# EasyEDA Pro project ProProject_开关电源实验平台_2024-07-17.epro, board PCB4
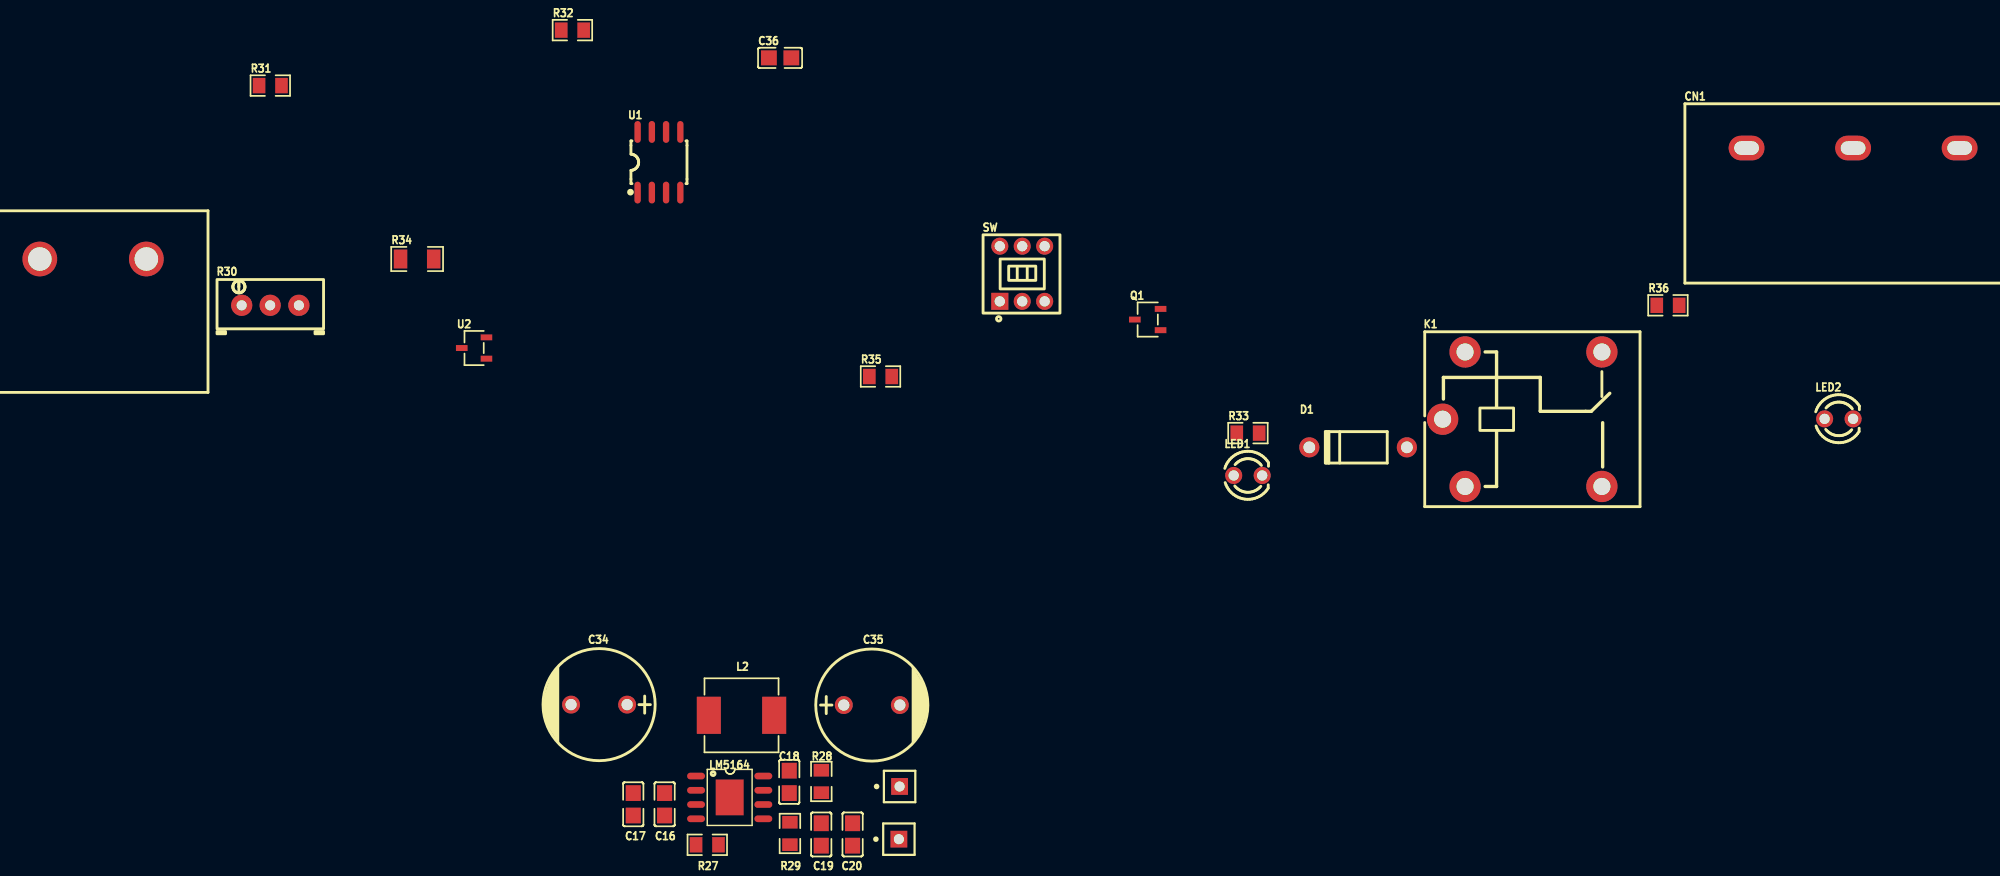
[diagram p4: board, top side]
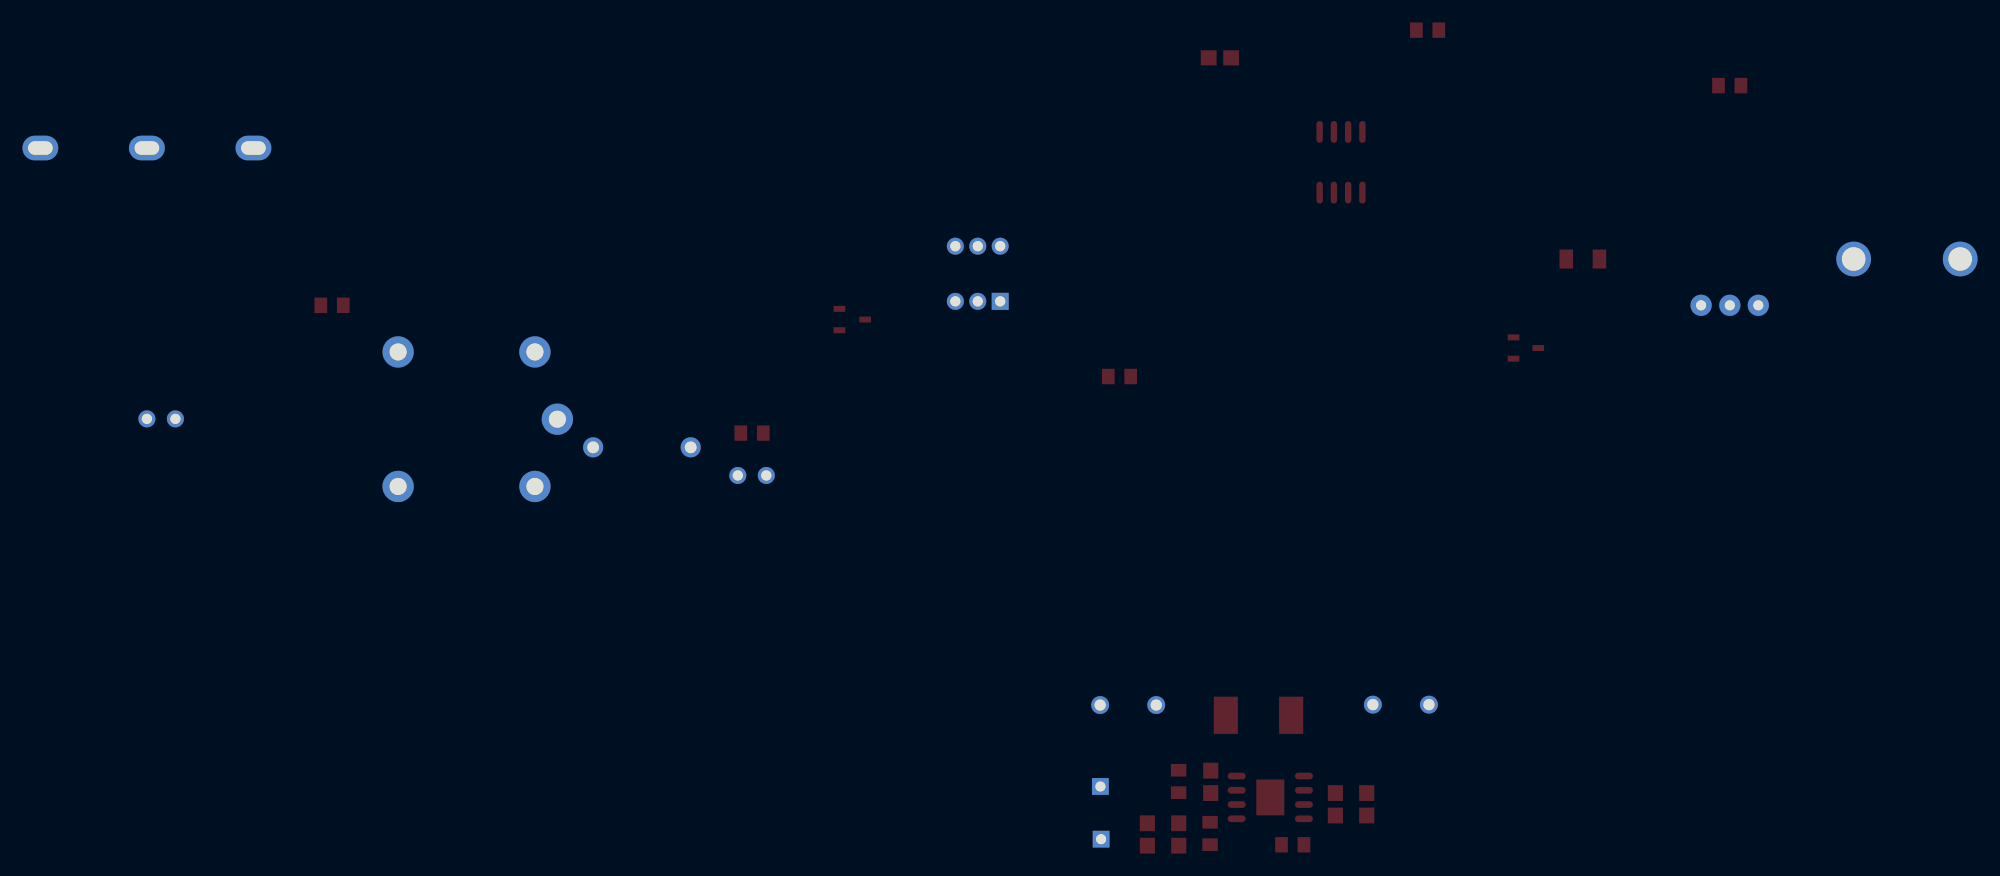
[diagram p5: board, bottom side, seen from below]

No outline. copper layers: Top Layer, Inner3, Inner4, Inner5, Inner6, Inner7, Inner8, Inner9, Inner10, Inner11, Inner12, Inner13, Inner14, Inner15, Inner16, Inner17, Inner18, Inner19, Inner20, Inner21, Inner22, Inner23, Inner24, Inner25, Inner26, Inner27, Inner28, Inner29, Inner30, Bottom Layer. Coordinates in mm from the lowest, leftmost part position.
Stack: Top Layer 0.035mm / Dielectric1 1.51mm FR4 er 4.5 / Bottom Layer 0.035mm

## Design rules (mm)
template: JLCPCB Capability(Two Layers Board)
spacing copperThickness1oz (default): track to track 0.102, other pairs 0.152 to 0.3
spacing copperThickness2oz: track to track 0.203, other pairs 0.152 to 0.3
track width copperThickness1oz (default): min 0.127, default 0.254, max 2.54
track width copperThickness2oz: min 0.203, default 0.254, max 2.54
differential pair differentialPair (default): width min 0.127, default 0.254, max 2.54; gap min 0.152, default 0.152
via viaSize (default): diameter min 0.5, default 0.61, max 10; hole min 0.3, default 0.305, max 6.3

## Placement (name value [footprint] x y rotation side)
C16  100nF  [c0805]  50.96 3.61 270 top
C17  100nF  [c0805]  48.17 3.61 270 top
C18  2.2nF  [c0805]  62.08 5.61 270 top
C19  100nF  [c0805]  64.93 0.92 90 top
C20  100nF  [c0805]  67.73 0.92 90 top
C34  100uF  [CAP-TH_BD10.0-P5.00-D0.6-FD]  45.12 12.5 180 top
C35  100uF  [CAP-TH_BD10.0-P5.00-D0.6-FD]  69.44 12.47 0 top
C36  100nF  [C0805]  61.26 70.2 0 top
CN1  HB9500-3P黑色  [CONN-TH_3P-P9.50_HB9500-9.5-3P]  156.94 62.16 0 top
D1  1N4007  [DO-41_BD2.4-L4.7-P8.70-D0.8-RD]  112.8 35.46 0 top
K1  SRD-DC12V-SL-C  [RELAY-TH_SRD-DCXXV-SL-C]  127.44 37.97 0 top
L2  10uH  [IND-SMD_L7.1-W6.6]  57.82 11.55 0 top
LED1  -  [LED_TH-3mm]  102.98 32.95 0 top
LED2  -  [LED_TH-3mm]  155.67 38 0 top
LM5164  LM5164DDAR  [SO-8_L4.9-W3.9-P1.27-LS6.0-BL-EP]  56.77 4.23 270 top
Q1  MCR100G-6-AD-AE3-R  [SOT-346_L2.9-W1.6-P1.90-LS2.8-TR-CW-1]  94.04 46.85 0 top
R27  30K  [R0805]  54.77 0 180 top
R28  470K  [R0805]  64.94 5.65 90 top
R29  51K  [R0805]  62.14 1.01 90 top
R30  100kΩ  [RES-ADJ-TH_3P-L9.5-W4.9-P2.50-L_3296W]  15.8 48.12 0 top
R31  10K  [R0805]  15.8 67.73 0 top
R32  10K  [R0805]  42.74 72.67 0 top
R33  1K  [R0805]  102.98 36.73 0 top
R34  1.2K  [R1206]  28.9 52.26 0 top
R35  240K  [R0805]  70.22 41.78 0 top
R36  2.2K  [R0805]  140.43 48.12 0 top
SW  -  [自锁开关]  82.92 50.99 0 top
TP14  -  [hdr1x1]  71.92 5.2 90 top
TP15  -  [hdr1x1]  71.86 0.5 90 top
U1  LM393DR  [SOIC-8_L5.0-W4.0-P1.27-LS6.0-BL]  50.46 60.89 0 top
U2  TL431  [SOT-23-3_L3.0-W1.7-P0.95-LS2.9-BR]  33.98 44.31 0 top
U3  DBT50G-9.5-2P  [CONN-TH_2P-P9.50_DBT50G-9.5-2P]  0 52.26 0 top

## Footprints (pads in the part's own frame, mm; a bottom-side part is the same pattern mirrored in y, then rotated)
C0805
  rect 1.41x1.35 smd: 1(-1,0) 2(1,0)
c0805
  rect 1.41x1.35 smd: 1(-1,0) 2(1,0)
CAP-TH_BD10.0-P5.00-D0.6-FD
  round 1.6 hole 1: 1(-2.5,0) 2(2.5,0)
CONN-TH_2P-P9.50_DBT50G-9.5-2P
  round 3.1 hole 2.1: 1(-4.75,0) 2(4.75,0)
CONN-TH_3P-P9.50_HB9500-9.5-3P
  oval 3.2x2.2 hole 2.2x1.2: 1(-9.499,0) 2(0,0) 3(9.499,0)
DO-41_BD2.4-L4.7-P8.70-D0.8-RD
  round 1.8 hole 1.05: 1(-4.35,0) 2(4.35,0)
hdr1x1
  rect 1.5x1.5 hole 0.9: 1(0,0)
IND-SMD_L7.1-W6.6
  rect 2.15x3.32 smd: 1(-2.913,0) 2(2.913,0)
LED_TH-3mm
  round 1.524 hole 0.914: 1(-1.27,0) 2(1.27,0)
R0805
  rect 1.133x1.377 smd: 1(-1,0) 2(1,0)
R1206
  rect 1.208x1.701 smd: 1(-1.479,0) 2(1.479,0)
RELAY-TH_SRD-DCXXV-SL-C
  round 2.794 hole 1.524: 1(-5.1,-6) 2(7.1,-6) 3(7.1,6) 4(-5.1,6) 5(-7.1,0)
RES-ADJ-TH_3P-L9.5-W4.9-P2.50-L_3296W
  round 1.9 hole 0.9: 1(-2.55,0) 2(-0.01,0) 3(2.55,0)
SO-8_L4.9-W3.9-P1.27-LS6.0-BL-EP
  oval 0.6x1.6 smd: 1(-1.905,-3) 2(-0.635,-3) 3(0.635,-3) 4(1.905,-3) 5(1.905,3) 6(0.635,3) 7(-0.635,3) 8(-1.905,3)
  rect 3.2x2.5 smd: 9(0,0)
SOIC-8_L5.0-W4.0-P1.27-LS6.0-BL
  oval 0.569x1.95 smd: 1(-1.905,-2.705) 2(-0.635,-2.705) 3(0.635,-2.705) 4(1.905,-2.705) 5(1.905,2.705) 6(0.635,2.705) 7(-0.635,2.705) 8(-1.905,2.705)
SOT-23-3_L3.0-W1.7-P0.95-LS2.9-BR
  rect 1.038x0.532 smd: 1(1.101,-0.95) 2(1.101,0.95) 3(-1.101,0)
SOT-346_L2.9-W1.6-P1.90-LS2.8-TR-CW-1
  rect 1.045x0.532 smd: 1(1.147,0.95) 2(1.147,-0.95) 3(-1.147,0)
自锁开关
  rect 1.524x1.524 hole 0.914: 1(-2.064,-2.508)
  round 1.524 hole 0.914: 2(-0.064,-2.508) 3(1.936,-2.508) 4(1.936,2.413) 5(-0.064,2.413) 6(-2.064,2.413)

## Nets
5V: C36.2 R32.2 R34.1 SW.2 SW.5 U1.8
+12V: C19.2 C20.2 C35.1 L2.2 R28.2 TP14.1
GND: C16.1 C17.1 C19.1 C20.1 C34.2 C35.2 C36.1 D1.2 K1.1 LED1.2 LED2.2 LM5164.1 LM5164.9 R27.1 R29.1 R30.1 TP15.1 U1.4 U2.2 U3.1
VIN: C16.2 C17.2 C34.1 CN1.2 K1.5 LM5164.2 LM5164.3 R31.2 U3.2
RLI_C: CN1.1 K1.3 R36.2
RLI_O: CN1.3 K1.2
$1N2455: R30.2 R30.3 R31.1 U1.3
$1N2546: R34.2 U1.2 U2.1 U2.3
$1N2835: R32.1 R35.2 U1.1
$1N2848: Q1.1 R35.1
$1N2857: Q1.3 SW.1 SW.4
$1N2932: LED1.1 R33.1
$1N3041: D1.1 K1.4 Q1.2 R33.2
$1N3141: LED2.1 R36.1
$1N51844: LM5164.4 R27.2
$1N51970: LM5164.5 R28.1 R29.2
$1N51986: C18.2 LM5164.7
$1N51989: C18.1 L2.1 LM5164.8

Pads without a net: LM5164 6; SW 3 6; U1 5 6 7
